# Altium schematic sheet Power.SchDoc
size A4; SheetNumber: 4; SheetTotal: 6
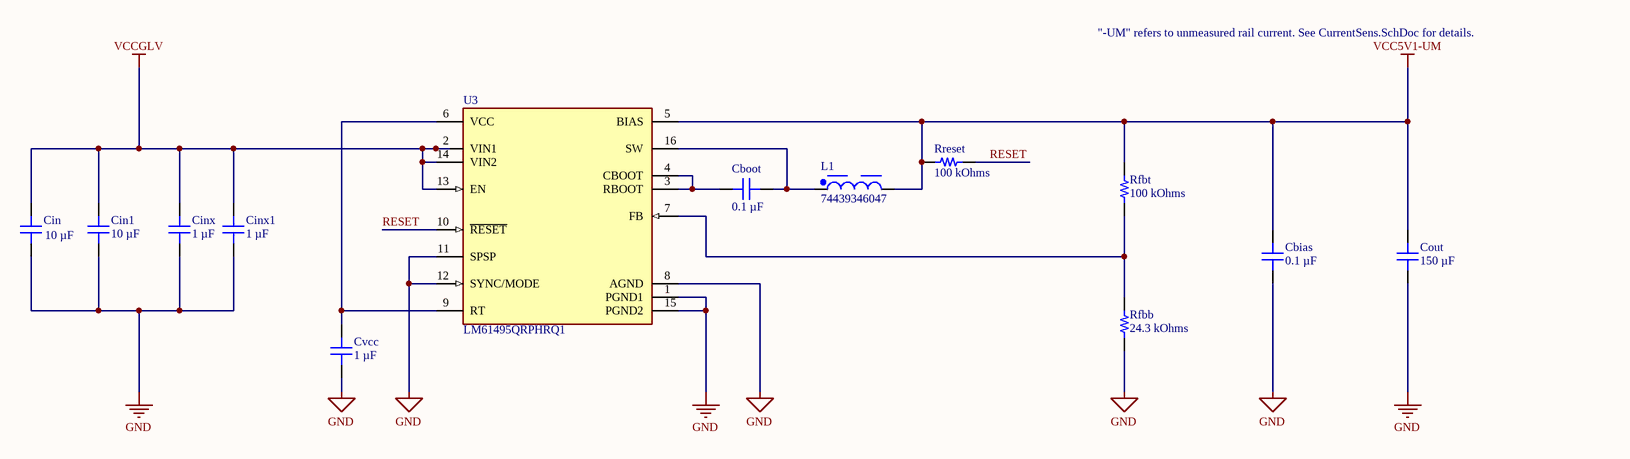
[diagram p0: Power.SchDoc]

## Parts
Cbias  0.1 µF  [CAP 0402_1005]
Cboot  0.1 µF  [CAP 0402_1005]
Cin  10 µF  [CAP 1210_3225 - 1MM]
Cin1  10 µF  [CAP 1210_3225 - 1MM]
Cinx  1 µF  [CAP 0603_1608]
Cinx1  1 µF  [CAP 0603_1608]
Cout  150 µF  [CAP 1210_3225 - 1MM]
Cvcc  1 µF  [CAP 0603_1608]
L1  74439346047  [WE-XHMI_6060_L6.65W6.45H5.8]
Rfbb  24.3 kOhms  [RES 0402_1005]
Rfbt  100 kOhms  [RES 0402_1005]
Rreset  100 kOhms  [RES 0402_1005]
U3  LM61495QRPHRQ1  [FP-RPH0016A-MFG]

## Nets
GND: Cbias.1 Cin.1 Cin1.1 Cinx.1 Cinx1.1 Cout.1 Cvcc.1 Rfbb.1 U3.1(PGND1) U3.8(AGND) U3.11(SPSP) U3.12(SYNC/MODE) U3.15(PGND2)
VCC5V1-UM: Cbias.2 Cout.2 L1.2 Rfbt.2 Rreset.1 U3.5(BIAS)
VCCGLV: Cin.2 Cin1.2 Cinx.2 Cinx1.2 U3.2(VIN1) U3.13(EN) U3.14(VIN2)
RESET: Rreset.2 U3.10(~{RESET})
NetCboot_1: Cboot.1 U3.3(RBOOT) U3.4(CBOOT)
NetCboot_2: Cboot.2 L1.1 U3.16(SW)
NetCvcc_2: Cvcc.2 U3.6(VCC) U3.9(RT)
NetRfbb_2: Rfbb.2 Rfbt.1 U3.7(FB)

## Notes on the sheet
- "-UM" refers to unmeasured rail current. See CurrentSens.SchDoc for details.

## Library data of the parts
Cbias = CL05B104KO5NFNC: CAP CER 0.1UF 16V X7R 0402; manufacturer: Samsung Electro-Mechanics; Tolerance: ±10%; Part Number: CL05B104KO5NFNC; Value: 0.1 µF; Applications: General Purpose; Capacitance: 0.1 µF; componentlink1description: Datasheet; componentlink1url: http://www.samsungsem.com/kr/support/product-search/mlcc/CL05B104KO5NFNC.jsp; componentlink2description: DigiKey Link; componentlink2url: https://www.digikey.com/en/products/detail/samsung-electro-mechanics/CL05B104KO5NFNC/3887166; Device Package: 0402 (1005 Metric); lastupdated: 2023-12-31 8:04:20 PM; Lifecycle Status: Active; Minimum Order: 1; Mounting Type: Surface Mount, MLCC; Operating Temperature: -55°C ~ 125°C; Package / Case: 0402 (1005 Metric); packaging: CutTape; partid: 11675; Part Status: Active; price: 0.01; series: CL; Size / Dimension: 0.039" L x 0.020" W (1.00mm x 0.50mm); Supplier 1: DigiKey; Supplier Part Number 1: 1276-1508-1-ND; Temperature Coefficient: X7R; Thickness (Max): 0.022" (0.55mm); Voltage - Rated: 16V
Cboot = CL05B104KP5NNNC: CAP CER 0.1UF 10V X7R 0402; manufacturer: Samsung Electro-Mechanics; Tolerance: ±10%; Part Number: CL05B104KP5NNNC; Value: 0.1 µF; Applications: General Purpose; Capacitance: 0.1 µF; componentlink1description: Datasheet; componentlink1url: http://www.samsungsem.com/kr/support/product-search/mlcc/CL05B104KP5NNNC.jsp; componentlink2description: DigiKey Link; componentlink2url: https://www.digikey.com/en/products/detail/samsung-electro-mechanics/CL05B104KP5NNNC/3886660; Device Package: 0402 (1005 Metric); lastupdated: 2023-12-31 8:04:29 PM; Lifecycle Status: Active; Minimum Order: 1; Mounting Type: Surface Mount, MLCC; Operating Temperature: -55°C ~ 125°C; Package / Case: 0402 (1005 Metric); packaging: CutTape; partid: 6068; Part Status: Active; price: 0.01; series: CL; Size / Dimension: 0.039" L x 0.020" W (1.00mm x 0.50mm); Supplier 1: DigiKey; Supplier Part Number 1: 1276-1002-1-ND; Temperature Coefficient: X7R; Thickness (Max): 0.022" (0.55mm); Voltage - Rated: 10V
Cin Cin1 = GRM32ER71H106KA12L: CAP CER 10UF 50V X7R 1210; manufacturer: Murata Electronics; Tolerance: ±10%; Part Number: GRM32ER71H106KA12L; Value: 10 µF; Applications: General Purpose; Capacitance: 10 µF; componentlink1description: Datasheet; componentlink1url: https://www.murata.com/~/media/webrenewal/support/library/catalog/products/capacitor/mlcc/c02e.ashx?la=en-us; componentlink2description: DigiKey Link; componentlink2url: https://www.digikey.com/en/products/detail/murata-electronics/GRM32ER71H106KA12L/2548481; Device Package: 1210 (3225 Metric); lastupdated: 2023-12-31 8:40:05 PM; Lifecycle Status: Active; Minimum Order: 1; Mounting Type: Surface Mount, MLCC; Operating Temperature: -55°C ~ 125°C; Package / Case: 1210 (3225 Metric); packaging: TapeAndReel; partid: 49713; Part Status: Active; price: 0.34; series: GRM; Size / Dimension: 0.126" L x 0.098" W (3.20mm x 2.50mm); Supplier 1: DigiKey; Supplier Part Number 1: 490-6544-1-ND; Temperature Coefficient: X7R; Thickness (Max): 0.106" (2.70mm); Voltage - Rated: 50V
Cinx Cinx1 = C1608X5R1H105K080AB: CAP CER 1UF 50V X5R 0603; manufacturer: TDK Corporation; Tolerance: ±10%; Part Number: C1608X5R1H105K080AB; Value: 1 µF; Applications: General Purpose; Capacitance: 1 µF; componentlink1description: Datasheet; componentlink1url: https://product.tdk.com/info/en/catalog/datasheets/mlcc_commercial_general_en.pdf?ref_disty=digikey; componentlink2description: DigiKey Link; componentlink2url: https://www.digikey.com/en/products/detail/tdk-corporation/C1608X5R1H105K080AB/2732903; Device Package: 0603 (1608 Metric); Features: Low ESL; lastupdated: 2023-12-31 8:10:04 PM; Lifecycle Status: Active; Minimum Order: 1; Mounting Type: Surface Mount, MLCC; Operating Temperature: -55°C ~ 85°C; Package / Case: 0603 (1608 Metric); packaging: TapeAndReel; partid: 36337; Part Status: Active; price: 0.02; series: C; Size / Dimension: 0.063" L x 0.031" W (1.60mm x 0.80mm); Supplier 1: DigiKey; Supplier Part Number 1: 445-7468-1-ND; Temperature Coefficient: X5R; Thickness (Max): 0.035" (0.90mm); Voltage - Rated: 50V
Cout = CL32A157MQVNNNE: CAP CER 150UF 6.3V X5R 1210; manufacturer: Samsung Electro-Mechanics; Tolerance: ±20%; Part Number: CL32A157MQVNNNE; Value: 150 µF; Applications: General Purpose; Capacitance: 150 µF; componentlink1description: Datasheet; componentlink1url: http://www.samsungsem.com/kr/support/product-search/mlcc/CL32A157MQVNNNE.jsp; componentlink2description: DigiKey Link; componentlink2url: https://www.digikey.com/en/products/detail/samsung-electro-mechanics/CL32A157MQVNNNE/3889025; Device Package: 1210 (3225 Metric); lastupdated: 2023-12-31 8:40:03 PM; Lifecycle Status: Active; Minimum Order: 1; Mounting Type: Surface Mount, MLCC; Operating Temperature: -55°C ~ 85°C; Package / Case: 1210 (3225 Metric); packaging: TapeAndReel; partid: 23856; Part Status: Active; price: 0.35; series: CL; Size / Dimension: 0.126" L x 0.098" W (3.20mm x 2.50mm); Supplier 1: DigiKey; Supplier Part Number 1: 1276-3367-1-ND; Temperature Coefficient: X5R; Thickness (Max): 0.110" (2.80mm); Voltage - Rated: 6.3V
Cvcc = KGM15BR50J105KT: CAP CER 1UF 6.3V X5R 0603; manufacturer: KYOCERA AVX; Tolerance: ±10%; Part Number: KGM15BR50J105KT; Value: 1 µF; Applications: General Purpose; Capacitance: 1 µF; componentlink1description: Datasheet; componentlink1url: https://datasheets.kyocera-avx.com/cx5r.pdf; componentlink2description: DigiKey Link; componentlink2url: https://www.digikey.com/en/products/detail/kyocera-avx/KGM15BR50J105KT/717509; Device Package: 0603 (1608 Metric); lastupdated: 2023-12-31 8:09:09 PM; Lifecycle Status: Active; Minimum Order: 1; Mounting Type: Surface Mount, MLCC; Operating Temperature: -55°C ~ 85°C; Package / Case: 0603 (1608 Metric); packaging: TapeAndReel; partid: 53227; Part Status: Active; price: 0.02; series: KGM - X5R; Size / Dimension: 0.063" L x 0.031" W (1.60mm x 0.80mm); Supplier 1: DigiKey; Supplier Part Number 1: 478-KGM15BR50J105KTCT-ND; Temperature Coefficient: X5R; Thickness (Max): 0.037" (0.95mm); Voltage - Rated: 6.3V
L1 = CMP-207846-000039-2: FIXED IND 4.7UH 7.4A 13 MOHM; NexarPartId: 75811200; Test Frequency: 100kHz; Saturation Current: 6.5A; Inductance Tolerance: 20%; Self Resonant Frequency: 25MHz; Series Resistance: 13mΩ; Inductance: 4.7µH; Width: 6.45mm; Mount: Surface Mount; Ambient Temperature Range High: 85°C; Max Operating Temperature: 125°C; RMS Current (Irms): 7.4A; Length: 6.65mm; Height: 6.1mm; RoHS: Compliant; REACH SVHC: No SVHC; DC Resistance (DCR): 13mΩ; Current Rating: 7.4A; Tolerance: 20%; Ambient Temperature Range Low: -40°C; Min Operating Temperature: -40°C; Composition: Wirewound; Number of Pins: 2
Rfbb = CRCW040224K3FKTD: RES SMD 24.3K OHM 1% 1/16W 0402; Manufacturer: Vishay Dale; Power (Watts): 0.063W, 1/16W; Temperature Coefficient: ±100ppm/°C; Part Number: CRCW040224K3FKTD; Value: 24.3 kOhms; ComponentLink1Description: Datasheet; ComponentLink1URL: https://www.vishay.com/docs/20008/dcrcw.pdf; ComponentLink2Description: DigiKey Link; ComponentLink2URL: https://www.digikey.com/en/products/detail/vishay-dale/CRCW040224K3FKTD/1221116; Composition: Thick Film; Device Package: 0402 (1005 Metric); Features: Automotive AEC-Q200; Height - Seated (Max): 0.016" (0.40mm); LastUpdated: 2023-12-31 8:26:27 PM; Lifecycle Status: Active; Minimum Order: 1; Number of Terminations: 2; Operating Temperature: -55°C ~ 155°C; Package / Case: 0402 (1005 Metric); Packaging: TapeAndReel; PartId: 81813; Price: 0.01; Ratings: AEC-Q200; Resistance: 24.3 kOhms; Series: CRCW; Size / Dimension: 0.039" L x 0.020" W (1.00mm x 0.50mm); Supplier 1: DigiKey; Supplier Part Number 1: 541-CRCW040224K3FKTDCT-ND; Supplier Device Package: 0402; Tolerance: ±1%
Rfbt Rreset = CRCW0402100KFKED: RES SMD 100K OHM 1% 1/16W 0402; Manufacturer: Vishay Dale; Power (Watts): 0.063W, 1/16W; Temperature Coefficient: ±100ppm/°C; Part Number: CRCW0402100KFKED; Value: 100 kOhms; ComponentLink1Description: Datasheet; ComponentLink1URL: http://www.vishay.com/docs/20035/dcrcwe3.pdf; ComponentLink2Description: DigiKey Link; ComponentLink2URL: https://www.digikey.com/en/products/detail/vishay-dale/CRCW0402100KFKED/1178235; Composition: Thick Film; Device Package: 0402 (1005 Metric); Features: Automotive AEC-Q200; Height - Seated (Max): 0.016" (0.40mm); LastUpdated: 2023-12-31 8:27:39 PM; Lifecycle Status: Active; Minimum Order: 1; Number of Terminations: 2; Operating Temperature: -55°C ~ 155°C; Package / Case: 0402 (1005 Metric); Packaging: CutTape; PartId: 11959; Part Status: Active; Price: 0.01; Ratings: AEC-Q200; Resistance: 100 kOhms; Series: CRCW; Size / Dimension: 0.039" L x 0.020" W (1.00mm x 0.50mm); Supplier 1: DigiKey; Supplier Part Number 1: 541-100KLCT-ND; Supplier Device Package: 0402; Tolerance: ±1%
U3 = CMP-04918-000418-1: 10-A automotive buck converter optimized for power density and low EMI 16-VQFN-HR -40 to 150